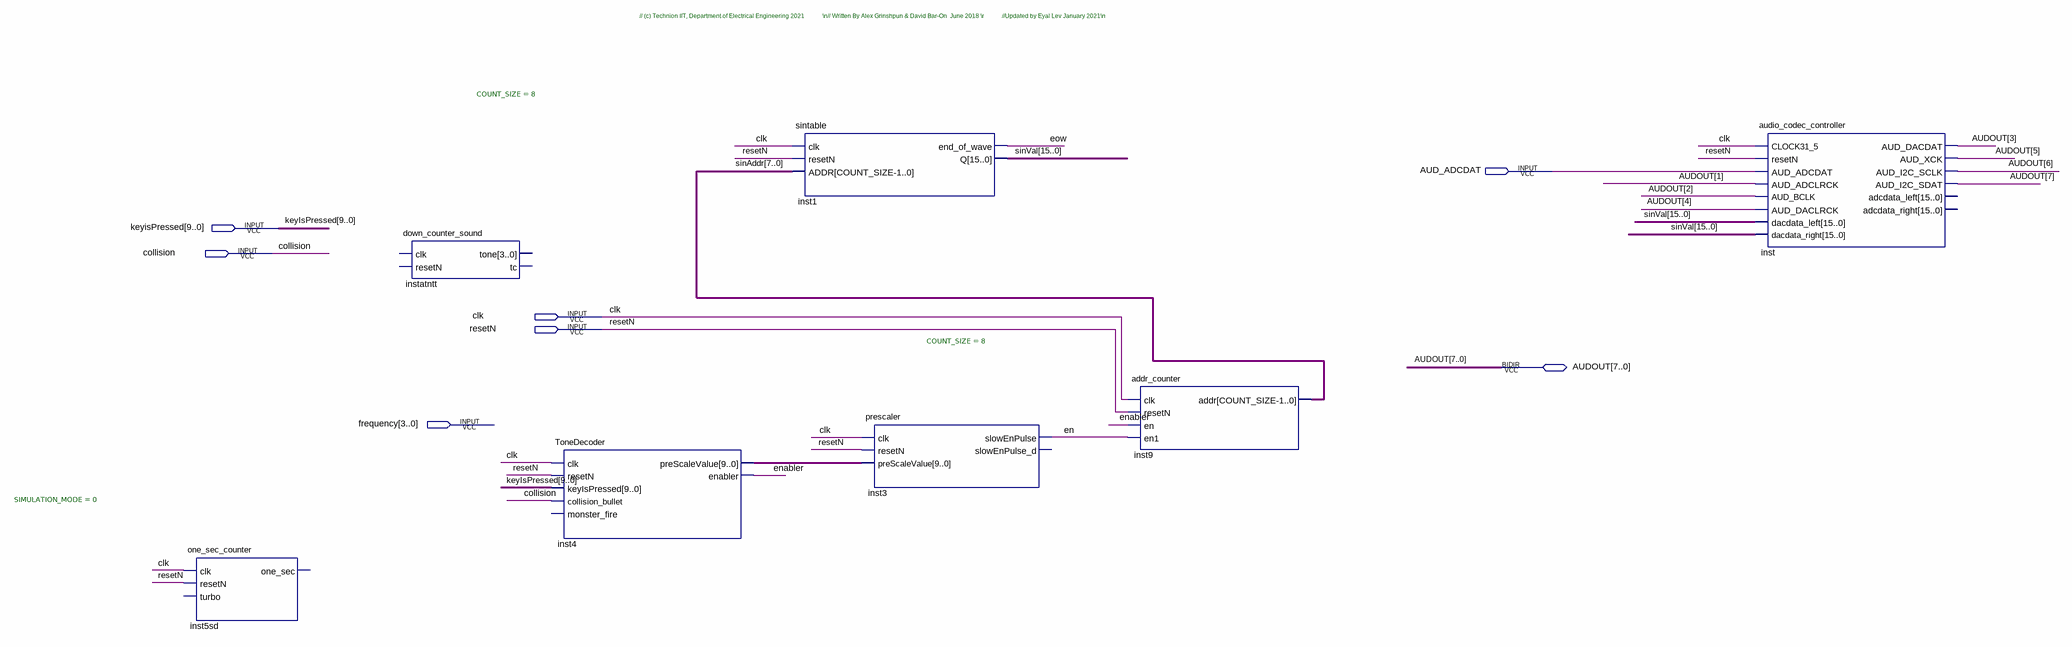
[diagram p0: schematic sheet]
// Quartus schematic AUDIO.bdf as structural Verilog: 7 symbols, 7 pins
module AUDIO (
  input  AUD_ADCDAT,
  input  [9:0] keyisPressed,
  input  collision,
  input  clk,
  input  resetN,
  input  [3:0] frequency,
  inout  [7:0] AUDOUT
);

  wire en, enabler, eow;
  wire [7:0] sinAddr;
  wire [9:0] inst4_prescalevalue;
  wire [15:0] sinVal;

  one_sec_counter #(.SIMULATION_MODE(0)) inst5sd (.clk(clk), .resetN(resetN));  // open: turbo, one_sec
  down_counter_sound instatntt ();  // open: clk, resetN, tone, tc
  ToneDecoder inst4 (
    .clk(clk), .resetN(resetN), .keyIsPressed(keyisPressed), .collision_bullet(collision),
    .preScaleValue(inst4_prescalevalue), .enabler(enabler));  // open: monster_fire
  sintable #(.COUNT_SIZE(8)) inst1 (.clk(clk), .resetN(resetN), .ADDR(sinAddr), .end_of_wave(eow), .Q(sinVal));
  prescaler inst3 (
    .clk(clk), .resetN(resetN), .preScaleValue(inst4_prescalevalue), .slowEnPulse(en));  // open: slowEnPulse_d
  addr_counter #(.COUNT_SIZE(8)) inst9 (.clk(clk), .resetN(resetN), .en(enabler), .en1(en), .addr(sinAddr));
  audio_codec_controller inst (
    .CLOCK31_5(clk), .resetN(resetN), .AUD_ADCDAT(AUD_ADCDAT), .AUD_ADCLRCK(AUDOUT[1]), .AUD_BCLK(AUDOUT[2]),
    .AUD_DACLRCK(AUDOUT[4]), .dacdata_left(sinVal), .dacdata_right(sinVal), .AUD_DACDAT(AUDOUT[3]),
    .AUD_XCK(AUDOUT[5]), .AUD_I2C_SCLK(AUDOUT[6]), .AUD_I2C_SDAT(AUDOUT[7]));  // open: adcdata_left, adcdata_right

  // Notes on the sheet:
  //   // (c) Technion IIT, Department of Electrical Engineering 2021            \n// Written By Alex Grinshpun & David Bar-On  June 2018 \r            //Updated by Eyal Lev January 2021\n
endmodule
